# EAGLE schematic power_1 (EAGLE 7.2.0)
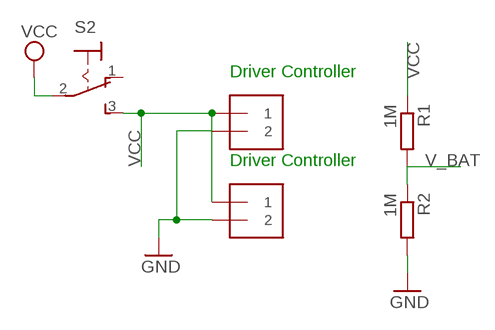
[diagram p0: schematic, sheet 1]

## Parts
J1  1X2-3.5MM  [1X2-3.5MM]
J2  1X2-3.5MM  [1X2-3.5MM]
R1  1M  R0204/7  [0204/7]
R2  1M  R0204/7  [0204/7]
S2  320-916  [320-916]

## Nets
GND: J1.2 J2.2 R2.2
V_BAT: R1.2 R2.1
VCC: J1.1 J2.1 R1.1 S2.2(P) S2.3(S)
Unconnected: S2.1(O)

## Notes on the sheet
- Driver Controller
- Driver Controller

## Library data of the parts
J1 J2 = adafruit:1X2: 3.5mm Terminal block http://www.ladyada.net/library/pcb/eaglelibrary.html
R1 R2 = eagle-ltspice:R: RESISTOR, European symbol; SPICEMODEL: NONE; SPICEPREFIX: R
S2 = switch:320-916: TOGGLE SWITCH distributor RS Components